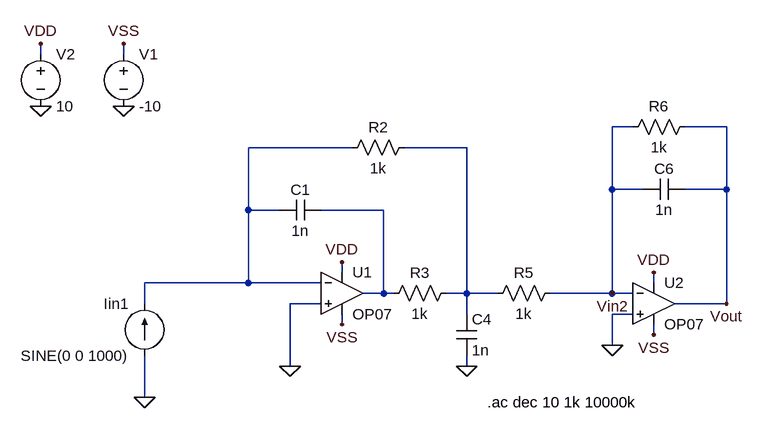
[diagram p0: schematic Draft3.asc]
Draft3.asc, the LTspice schematic file:
Version 4
SHEET 1 880 680
WIRE -432 -176 -432 -192
WIRE -304 -176 -304 -192
WIRE 480 -64 448 -64
WIRE 624 -64 560 -64
WIRE 48 -32 -112 -32
WIRE 224 -32 128 -32
WIRE 448 32 448 -64
WIRE 496 32 448 32
WIRE 624 32 624 -64
WIRE 624 32 560 32
WIRE -112 64 -112 -32
WIRE -64 64 -112 64
WIRE 96 64 0 64
WIRE 32 160 32 144
WIRE -112 176 -112 64
WIRE -112 176 -272 176
WIRE 0 176 -112 176
WIRE 512 176 512 160
WIRE 96 192 96 64
WIRE 96 192 64 192
WIRE 112 192 96 192
WIRE 224 192 224 -32
WIRE 224 192 192 192
WIRE 272 192 224 192
WIRE 448 192 448 32
WIRE 448 192 352 192
WIRE 480 192 448 192
WIRE -272 208 -272 176
WIRE 0 208 -48 208
WIRE 624 208 624 32
WIRE 624 208 544 208
WIRE 224 224 224 192
WIRE 480 224 448 224
WIRE 32 240 32 224
WIRE 512 256 512 240
WIRE 448 272 448 224
WIRE -48 304 -48 208
WIRE 224 304 224 288
WIRE -272 352 -272 288
FLAG -304 -96 0
FLAG -432 -96 0
FLAG -432 -192 VDD
FLAG -304 -192 VSS
FLAG 32 144 VDD
FLAG 32 240 VSS
FLAG -272 352 0
FLAG -48 304 0
FLAG 224 304 0
FLAG 512 160 VDD
FLAG 512 256 VSS
FLAG 448 272 0
FLAG 624 208 Vout
FLAG 448 192 Vin2
SYMBOL OP07 32 128 R0
SYMATTR InstName U1
SYMBOL voltage -304 -192 R0
SYMATTR InstName V1
SYMATTR Value -10
SYMBOL voltage -432 -192 R0
SYMATTR InstName V2
SYMATTR Value 10
SYMBOL current -272 288 R180
WINDOW 0 24 80 Left 2
WINDOW 3 24 0 Left 2
SYMATTR InstName Iin1
SYMATTR Value SINE(0 0 1000)
SYMATTR Value2 AC 1
SYMBOL Res 144 -48 R90
WINDOW 0 0 56 VBottom 2
WINDOW 3 32 56 VTop 2
SYMATTR InstName R2
SYMATTR Value 1k
SYMBOL Res 208 176 R90
WINDOW 0 0 56 VBottom 2
WINDOW 3 32 56 VTop 2
SYMATTR InstName R3
SYMATTR Value 1k
SYMBOL Cap 208 224 R0
SYMATTR InstName C4
SYMATTR Value 1n
SYMBOL Res 368 176 R90
WINDOW 0 0 56 VBottom 2
WINDOW 3 32 56 VTop 2
SYMATTR InstName R5
SYMATTR Value 1k
SYMBOL OP07 512 144 R0
SYMATTR InstName U2
SYMBOL Res 576 -80 R90
WINDOW 0 0 56 VBottom 2
WINDOW 3 32 56 VTop 2
SYMATTR InstName R6
SYMATTR Value 1k
SYMBOL Cap 0 48 R90
WINDOW 0 0 32 VBottom 2
WINDOW 3 32 32 VTop 2
SYMATTR InstName C1
SYMATTR Value 1n
SYMBOL Cap 560 16 R90
WINDOW 0 0 32 VBottom 2
WINDOW 3 32 32 VTop 2
SYMATTR InstName C6
SYMATTR Value 1n
TEXT 256 360 Left 2 !.ac dec 10 1k 10000k

The netlist it stands for:
* Draft3.asc
XU1 0 N001 VDD VSS N003 LT1001  ; OP07, pins In+ In- V+ V- OUT
V1 VSS 0 -10
V2 VDD 0 10
Iin1 0 N001 SINE(0 0 1000) AC 1
R2 N002 N001 1k
R3 N002 N003 1k
C4 N002 0 1n
R5 Vin2 N002 1k
XU2 0 Vin2 VDD VSS Vout LT1001  ; OP07, pins In+ In- V+ V- OUT
R6 Vout Vin2 1k
C1 N003 N001 1n
C6 Vout Vin2 1n
.ac dec 10 1k 10000k
.lib LTC.lib
.backanno
.end